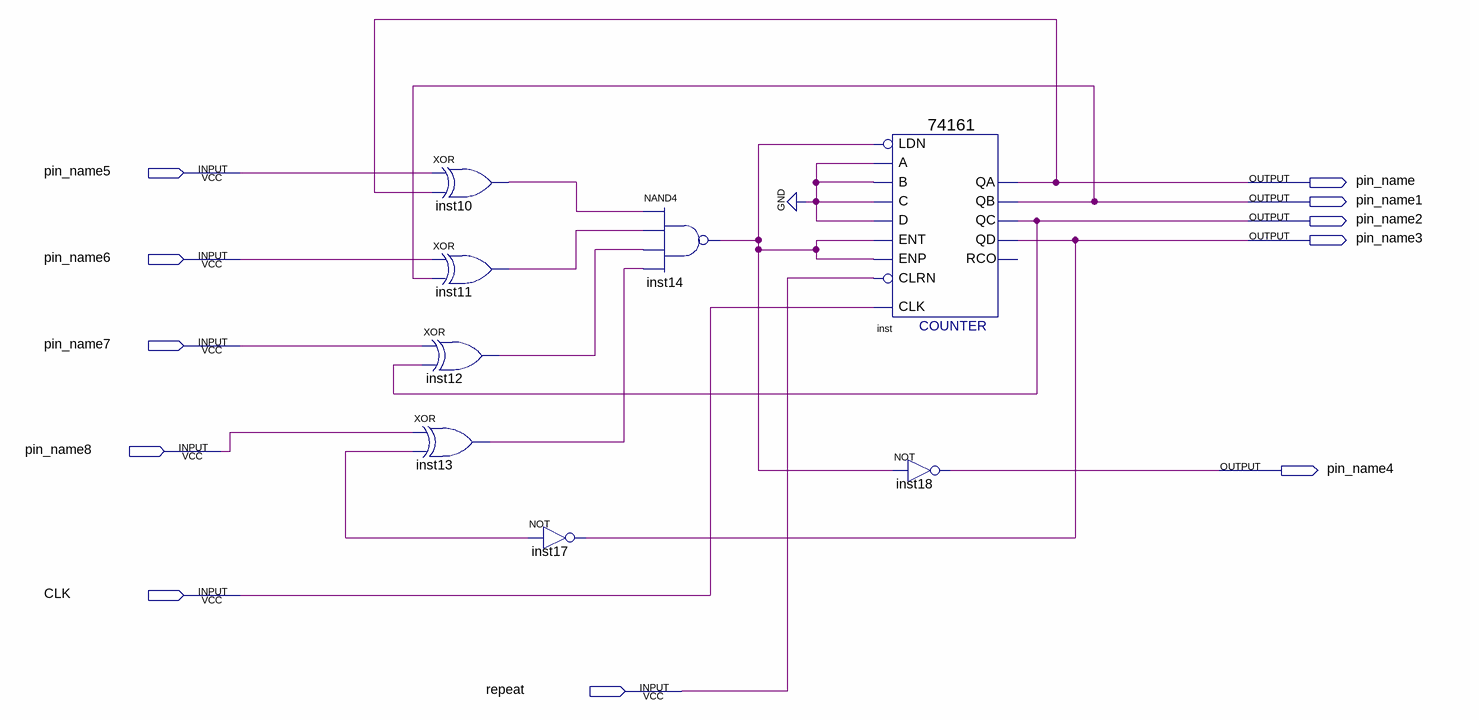
[diagram p0: schematic sheet]
// Quartus schematic lab122.bdf as structural Verilog: 8 symbols, 11 pins
module lab122 (
  input  pin_name5,
  input  pin_name6,
  input  pin_name7,
  input  pin_name8,
  input  CLK,
  input  \repeat ,
  output pin_name,
  output pin_name1,
  output pin_name2,
  output pin_name3,
  output pin_name4
);

  wire inst10_out, inst11_out, inst12_out, inst13_out, inst14_out, undriven;

  xor inst10 (inst10_out, pin_name5, pin_name);
  xor inst11 (inst11_out, pin_name6, pin_name1);
  xor inst12 (inst12_out, pin_name7, pin_name2);
  xor inst13 (inst13_out, pin_name8, undriven);
  not inst17 (pin_name3, undriven);
  nand inst14 (inst14_out, inst10_out, inst11_out, inst12_out, inst13_out);
  \74161  inst (
    .CLRN(\repeat ), .CLK(CLK), .ENP(inst14_out), .LDN(inst14_out), .A(1'b0), .D(1'b0), .ENT(inst14_out),
    .B(1'b0), .C(1'b0), .QD(pin_name3), .QC(pin_name2), .QB(pin_name1), .QA(pin_name));  // open: RCO
  not inst18 (pin_name4, inst14_out);
endmodule
